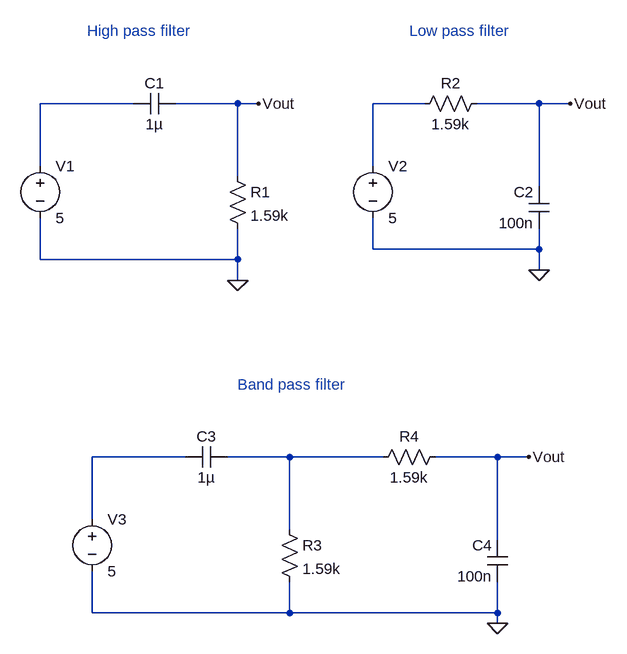
[diagram p0: schematic RC Filter.asc]
RC Filter.asc, the LTspice schematic file:
Version 4
SHEET 1 880 680
WIRE 16 -1360 -128 -1360
WIRE 176 -1360 80 -1360
WIRE 208 -1360 176 -1360
WIRE 464 -1360 384 -1360
WIRE 640 -1360 544 -1360
WIRE 688 -1360 640 -1360
WIRE -128 -1264 -128 -1360
WIRE 384 -1264 384 -1360
WIRE 176 -1248 176 -1360
WIRE 640 -1232 640 -1360
WIRE 384 -1136 384 -1184
WIRE 640 -1136 640 -1168
WIRE 640 -1136 384 -1136
WIRE -128 -1120 -128 -1184
WIRE 176 -1120 176 -1168
WIRE 176 -1120 -128 -1120
WIRE 640 -1104 640 -1136
WIRE 176 -1088 176 -1120
WIRE 96 -816 -48 -816
WIRE 256 -816 160 -816
WIRE 400 -816 256 -816
WIRE 576 -816 480 -816
WIRE 624 -816 576 -816
WIRE -48 -720 -48 -816
WIRE 256 -704 256 -816
WIRE 576 -688 576 -816
WIRE -48 -576 -48 -640
WIRE 256 -576 256 -624
WIRE 256 -576 -48 -576
WIRE 576 -576 576 -624
WIRE 576 -576 256 -576
WIRE 576 -560 576 -576
FLAG 176 -1088 0
FLAG 640 -1104 0
FLAG 208 -1360 Vout
FLAG 688 -1360 Vout
FLAG 576 -560 0
FLAG 624 -816 Vout
SYMBOL cap 80 -1376 R90
WINDOW 0 0 32 VBottom 2
WINDOW 3 32 32 VTop 2
SYMATTR InstName C1
SYMATTR Value 1µ
SYMBOL cap 656 -1168 R180
WINDOW 0 24 56 Left 2
WINDOW 3 24 8 Left 2
SYMATTR InstName C2
SYMATTR Value 100n
SYMBOL res 160 -1264 R0
SYMATTR InstName R1
SYMATTR Value 1.59k
SYMBOL res 560 -1376 R90
WINDOW 0 0 56 VBottom 2
WINDOW 3 32 56 VTop 2
SYMATTR InstName R2
SYMATTR Value 1.59k
SYMBOL voltage -128 -1280 R0
WINDOW 123 0 0 Left 0
WINDOW 39 0 0 Left 0
SYMATTR InstName V1
SYMATTR Value 5
SYMBOL voltage 384 -1280 R0
WINDOW 123 0 0 Left 0
WINDOW 39 0 0 Left 0
SYMATTR InstName V2
SYMATTR Value 5
SYMBOL cap 160 -832 R90
WINDOW 0 0 32 VBottom 2
WINDOW 3 32 32 VTop 2
SYMATTR InstName C3
SYMATTR Value 1µ
SYMBOL cap 592 -624 R180
WINDOW 0 24 56 Left 2
WINDOW 3 24 8 Left 2
SYMATTR InstName C4
SYMATTR Value 100n
SYMBOL res 240 -720 R0
SYMATTR InstName R3
SYMATTR Value 1.59k
SYMBOL res 496 -832 R90
WINDOW 0 0 56 VBottom 2
WINDOW 3 32 56 VTop 2
SYMATTR InstName R4
SYMATTR Value 1.59k
SYMBOL voltage -48 -736 R0
WINDOW 123 0 0 Left 0
WINDOW 39 0 0 Left 0
SYMATTR InstName V3
SYMATTR Value 5
TEXT -56 -1472 Left 2 ;High pass filter
TEXT 440 -1472 Left 2 ;Low pass filter
TEXT 176 -928 Left 2 ;Band pass filter

The netlist it stands for:
* RC Filter.asc
C1 Vout N001 1µ
C2 0 Vout 100n
R1 Vout 0 1.59k
R2 Vout N002 1.59k
V1 N001 0 5
V2 N002 0 5
C3 N004 N003 1µ
C4 0 Vout 100n
R3 N004 0 1.59k
R4 Vout N004 1.59k
V3 N003 0 5
* High pass filter
* Low pass filter
* Band pass filter
.backanno
.end